# Altium schematic sheet 05_AUDIO.SchDoc
size A2; ApprovedBy: DNP; CheckedBy: DNP; Author: DNP; CompanyName: Google LLC; DrawnBy: DNP; Engineer: Bangfei/Michael/Leo; Organization: Google LLC; Address1: 1600 Amphitheatre Parkway; Address2: Mountain View, CA 94043; Address3: DNP; Address4: DNP; DocumentNumber: DNP; Revision: PVT; SheetNumber: 5; SheetTotal: 11; VersionControl_RevNumber: DNP; IsUserConfigurable: DNP; Time: DNP; ImagePath: DNP; Rule: DNP; ProjectName: Enterprise; Application_BuildNumber: DNP
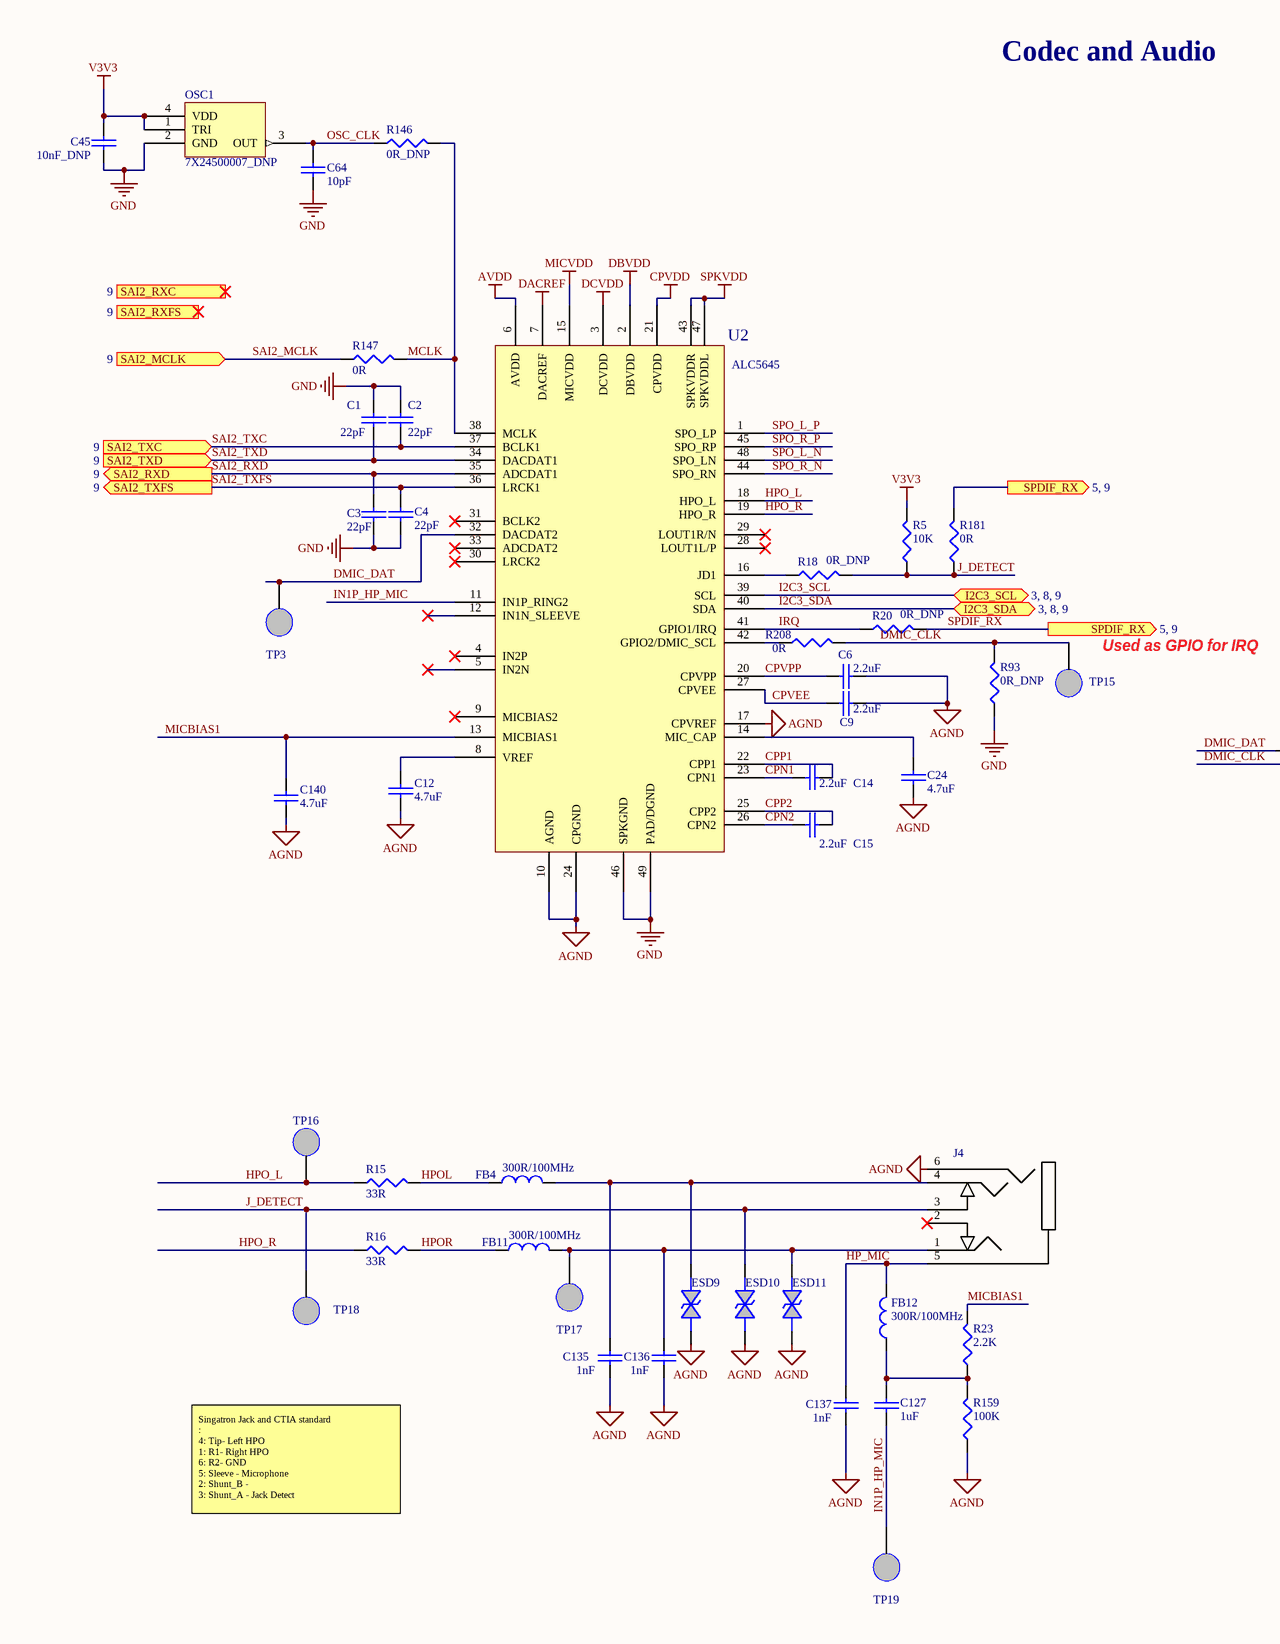
[diagram p0: 05_AUDIO.SchDoc, left]
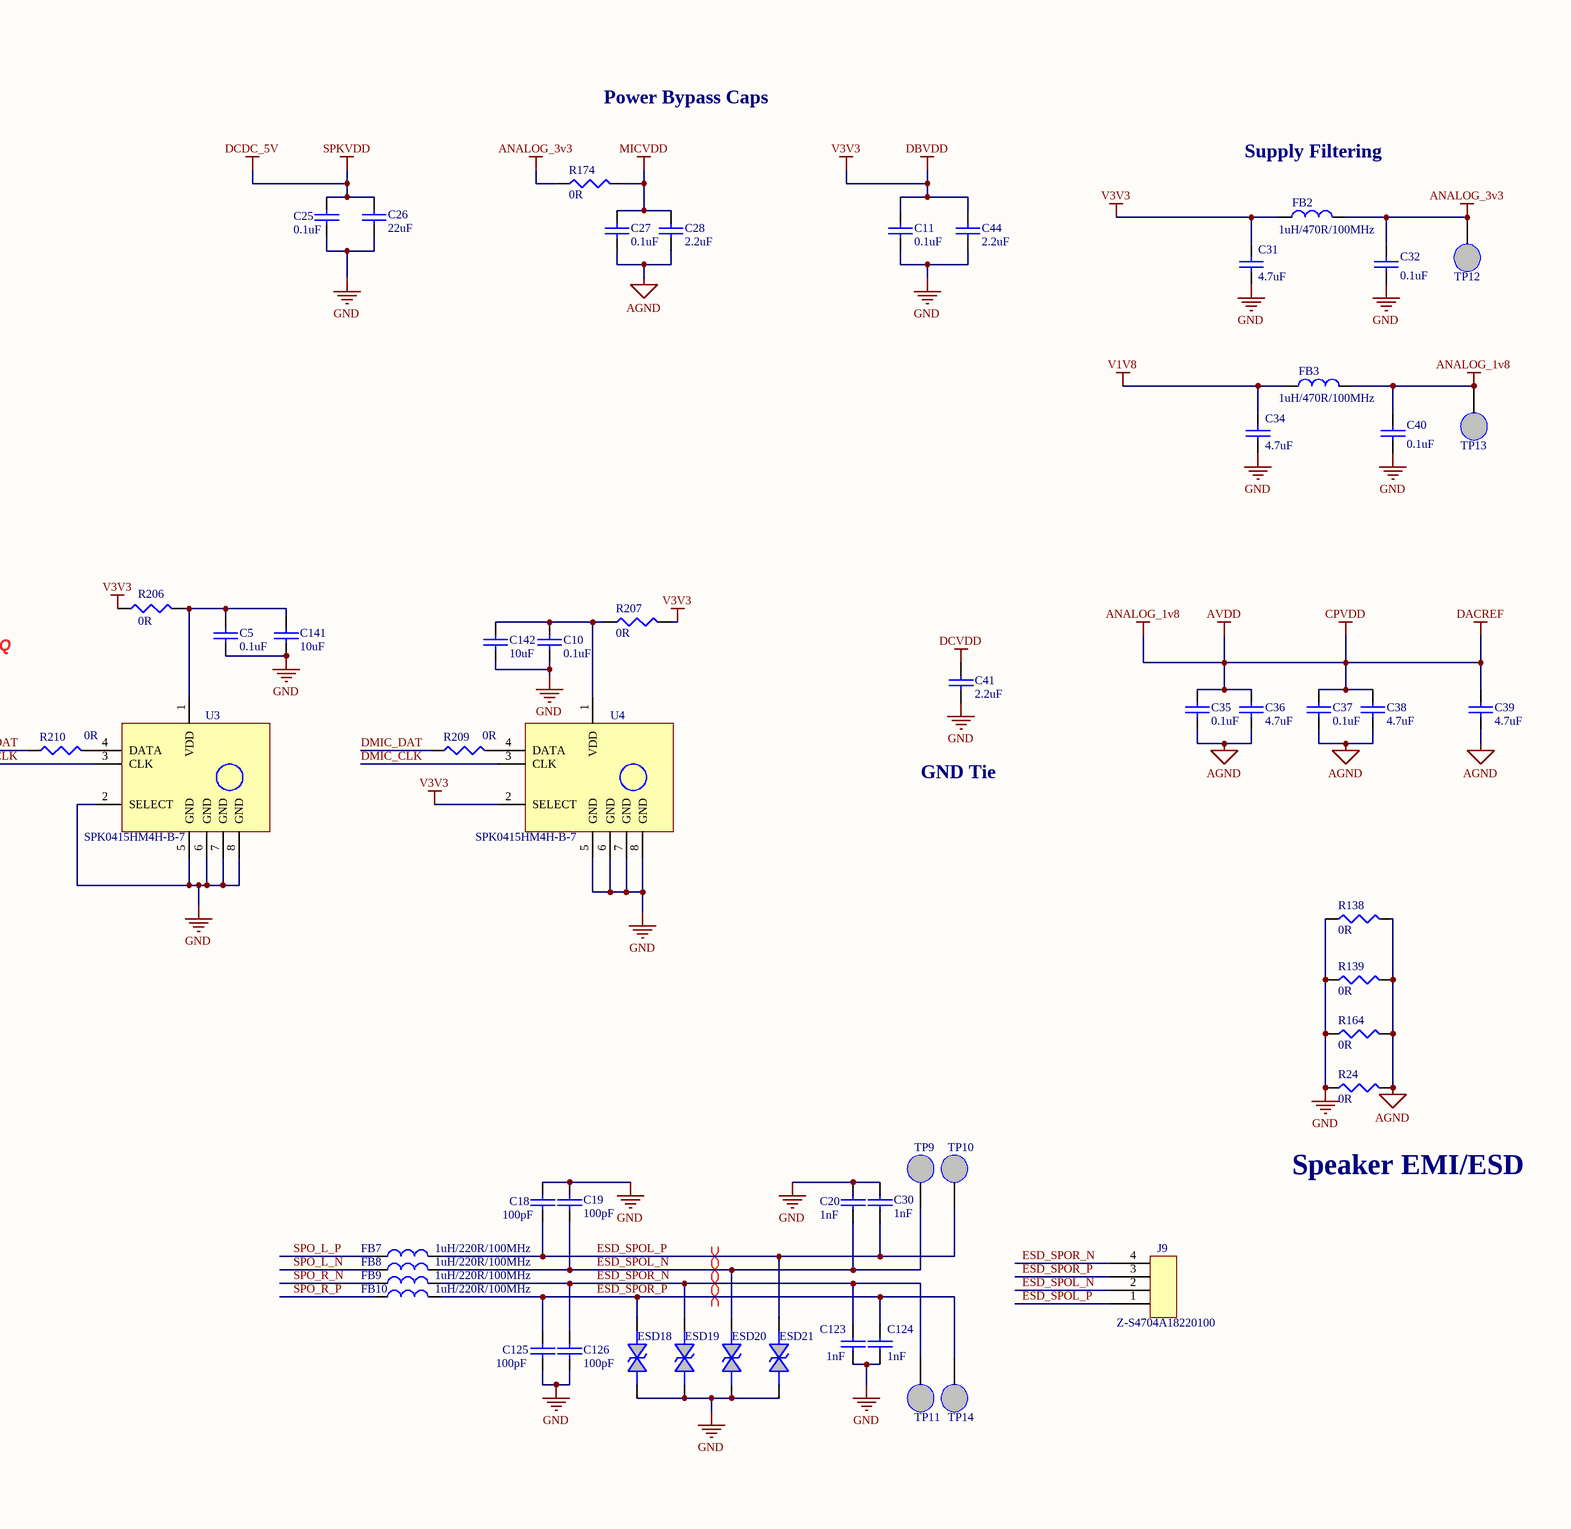
[diagram p1: 05_AUDIO.SchDoc, right]

## Parts
C1  value 22pF  [0201]  (hidden comment: 22pF/6.3V)
C2  value 22pF  [0201]  (hidden comment: 22pF/6.3V)
C3  value 22pF  [0201]  (hidden comment: 22pF/6.3V)
C4  value 22pF  [0201]  (hidden comment: 22pF/6.3V)
C5  value 0.1uF  [0201]  (hidden comment: 0.1uF/10V)
C6  value 2.2uF  [0201]  (hidden comment: 2.2uF/6.3V)
C9  value 2.2uF  [0201]  (hidden comment: 2.2uF/6.3V)
C10  value 0.1uF  [0201]  (hidden comment: 0.1uF/10V)
C11  value 0.1uF  [0201]  (hidden comment: 0.1uF/10V)
C12  value 4.7uF  [0402]  (hidden comment: 4.7uF/10V)
C14  value 2.2uF  [0201]  (hidden comment: 2.2uF/6.3V)
C15  value 2.2uF  [0201]  (hidden comment: 2.2uF/6.3V)
C18  value 100pF  [0201]  (hidden comment: 100pF/25V)
C19  value 100pF  [0201]  (hidden comment: 100pF/25V)
C20  value 1nF  [0201]  (hidden comment: 1nF/25V)
C24  value 4.7uF  [0402]  (hidden comment: 4.7uF/10V)
C25  value 0.1uF  [0402]  (hidden comment: 0.1uF/16V)
C26  value 22uF  [0603]  (hidden comment: 10uF/10V)
C27  value 0.1uF  [0201]  (hidden comment: 0.1uF/10V)
C28  value 2.2uF  [0201]  (hidden comment: 2.2uF/6.3V)
C30  value 1nF  [0201]  (hidden comment: 1nF/25V)
C31  value 4.7uF  [0402]  (hidden comment: 4.7uF/10V)
C32  value 0.1uF  [0603]  (hidden comment: 0.1uF/10V)
C34  value 4.7uF  [0402]  (hidden comment: 4.7uF/10V)
C35  value 0.1uF  [0201]  (hidden comment: 0.1uF/10V)
C36  value 4.7uF  [0402]  (hidden comment: 4.7uF/10V)
C37  value 0.1uF  [0201]  (hidden comment: 0.1uF/10V)
C38  value 4.7uF  [0402]  (hidden comment: 4.7uF/10V)
C39  value 4.7uF  [0402]  (hidden comment: 4.7uF/10V)
C40  value 0.1uF  [0402]  (hidden comment: 0.1uF/16V)
C41  value 2.2uF  [0201]  (hidden comment: 2.2uF/6.3V)
C44  value 2.2uF  [0201]  (hidden comment: 2.2uF/6.3V)
C45  10nF_DNP  [0201]
C64  value 10pF  [0201]  (hidden comment: 10pF/25V)
C123  value 1nF  [0201]  (hidden comment: 1nF/25V)
C124  value 1nF  [0201]  (hidden comment: 1nF/25V)
C125  value 100pF  [0201]  (hidden comment: 100pF/25V)
C126  value 100pF  [0201]  (hidden comment: 100pF/25V)
C127  value 1uF  [0402]  (hidden comment: 1uF/6.3V)
C135  value 1nF  [0201]  (hidden comment: 1nF/25V)
C136  value 1nF  [0201]  (hidden comment: 1nF/25V)
C137  value 1nF  [0201]  (hidden comment: 1nF/25V)
C140  value 4.7uF  [0402]  (hidden comment: 4.7uF/10V)
C141  value 10uF  [0402]  (hidden comment: 10uF/10V)
C142  value 10uF  [0402]  (hidden comment: 10uF/10V)
ESD9  3.5pF/5V  [0201]  (value not drawn)
ESD10  3.5pF/5V  [0201]  (value not drawn)
ESD11  3.5pF/5V  [0201]  (value not drawn)
ESD18  3.5pF/5V  [0201]  (value not drawn)
ESD19  3.5pF/5V  [0201]  (value not drawn)
ESD20  3.5pF/5V  [0201]  (value not drawn)
ESD21  3.5pF/5V  [0201]  (value not drawn)
FB2  1uH/470R/100MHz  [0603]
FB3  1uH/470R/100MHz  [0603]
FB4  300R/100MHz  [0402]
FB7  1uH/220R/100MHz  [0603]
FB8  1uH/220R/100MHz  [0603]
FB9  1uH/220R/100MHz  [0603]
FB10  1uH/220R/100MHz  [0603]
FB11  300R/100MHz  [0402]
FB12  300R/100MHz  [0402]
J4  CONN_2SJ2296-000111  [AUDIO-2SJ2296-000111]  (value not drawn)
J9  Z-S4704A18220100  [SIP4-2_54-S4704A18220100]
OSC1  7X24500007_DNP  [4-SMD-OSC]
R5  10K  [0201]
R15  33R  [0402]
R16  33R  [0402]
R18  0R_DNP  [0201]
R20  0R_DNP  [0201]
R23  2.2K  [0201]
R24  0R  [0201]
R93  0R_DNP  [0201]
R138  0R  [0201]
R139  0R  [0201]
R146  0R_DNP  [0201]
R147  0R  [0201]
R159  100K  [0402]
R164  0R  [0201]
R174  0R  [0402]
R181  0R  [0201]
R206  0R  [0201]
R207  0R  [0201]
R208  0R  [0201]
R209  0R  [0201]
R210  0R  [0201]
TP3  TP NM  [TP_SMD]  (value not drawn)  (no BOM)
TP9  TP NM  [TP_SMD]  (value not drawn)  (no BOM)
TP10  TP NM  [TP_SMD]  (value not drawn)  (no BOM)
TP11  TP NM  [TP_SMD]  (value not drawn)  (no BOM)
TP12  TP NM  [TP_SMD]  (value not drawn)  (no BOM)
TP13  TP NM  [TP_SMD]  (value not drawn)  (no BOM)
TP14  TP NM  [TP_SMD]  (value not drawn)  (no BOM)
TP15  TP NM  [TP_SMD]  (value not drawn)  (no BOM)
TP16  TP NM  [TP_SMD]  (value not drawn)  (no BOM)
TP17  TP NM  [TP_SMD]  (value not drawn)  (no BOM)
TP18  TP NM  [TP_SMD]  (value not drawn)  (no BOM)
TP19  TP NM  [TP_SMD]  (value not drawn)  (no BOM)
U2  ALC5645  [CODEC_ALC5645]
U3  SPK0415HM4H-B-7  [Microphone_SPK0415HM4H-B-7]
U4  SPK0415HM4H-B-7  [Microphone_SPK0415HM4H-B-7]

## Ports
I2C3_SCL (bidir, see 3, 8, 9), I2C3_SDA (bidir, see 3, 8, 9), SAI2_MCLK (in, see 9), SAI2_RXC (in, see 9), SAI2_RXD (out, see 9), SAI2_RXFS (in, see 9), SAI2_TXC (in, see 9), SAI2_TXD (in, see 9), SAI2_TXFS (out, see 9), SPDIF_RX (out, see 5, 9)

## Nets
AGND: C6.2 C9.2 C12.2 C24.1 C27.2 C28.2 C35.2 C36.2 C37.2 C38.2 C39.2 C135.1 C136.1 C137.1 C140.2 ESD9.1 ESD10.1 ESD11.1 J4.6(RING_B) R24.2 R138.2 R139.2 R159.1 R164.2 U2.10(AGND) U2.17(CPVREF) U2.24(CPGND)
ANALOG_1v8: C35.1 C36.1 C37.1 C38.1 C39.1 C40.1 FB3.2 TP13.1 U2.6(AVDD) U2.7(DACREF) U2.21(CPVDD)  [also labelled AVDD, CPVDD, DACREF]
ANALOG_3v3: C32.1 FB2.2 R174.1 TP12.1
DBVDD: C11.1 C31.1 C44.1 C45.1 FB2.1 OSC1.1(TRI) OSC1.4(VDD) R5.2 R206.1 R207.2 U2.2(DBVDD) U4.2(SELECT)  [also labelled V3V3]
DCDC_5V: C25.1 C26.1 U2.43(SPKVDDR) U2.47(SPKVDDL)  [also labelled SPKVDD]
DCVDD: C41.1 U2.3(DCVDD)
GND: C1.1 C2.1 C3.2 C4.2 C5.2 C10.2 C11.2 C18.1 C19.1 C20.2 C25.2 C26.2 C30.2 C31.2 C32.2 C34.2 C40.2 C41.2 C44.2 C45.2 C64.2 C123.1 C124.1 C125.2 C126.2 C141.2 C142.2 ESD18.1 ESD19.1 ESD20.1 ESD21.1 OSC1.2(GND) R24.1 R93.1 R138.1 R139.1 R164.1 U2.46(SPKGND) U2.49(PAD/DGND) U3.2(SELECT) U3.5(GND) U3.6(GND) U3.7(GND) U3.8(GND) U4.5(GND) U4.6(GND) U4.7(GND) U4.8(GND)
MICVDD: C27.1 C28.1 R174.2 U2.15(MICVDD)
V1V8: C34.1 FB3.1
CPN1: C14.1 U2.23(CPN1)
CPN2: C15.1 U2.26(CPN2)
CPP1: C14.2 U2.22(CPP1)
CPP2: C15.2 U2.25(CPP2)
CPVEE: C9.1 U2.27(CPVEE)
CPVPP: C6.1 U2.20(CPVPP)
DMIC_CLK: R93.2 R208.2 TP15.1 U3.3(CLK) U4.3(CLK)
DMIC_DAT: R209.1 R210.1 TP3.1 U2.32(DACDAT2)
ESD_SPOL_N: C19.2 C20.1 ESD20.2 FB8.2 J9.2 TP9.1
ESD_SPOL_P: C18.2 C30.1 ESD21.2 FB7.2 J9.1 TP10.1
ESD_SPOR_N: C123.2 C126.1 ESD19.2 FB9.2 J9.4 TP11.1
ESD_SPOR_P: C124.2 C125.1 ESD18.2 FB10.2 J9.3 TP14.1
HP_MIC: C137.2 FB12.2 J4.5(SLEEVE)
HPO_L: R15.1 TP16.1 U2.18(HPO_L)
HPO_R: R16.1 U2.19(HPO_R)
HPOL: FB4.1 R15.2
HPOR: FB11.1 R16.2
I2C3_SCL: U2.39(SCL) ; port I2C3_SCL
I2C3_SDA: U2.40(SDA) ; port I2C3_SDA
IN1P_HP_MIC: C127.2 TP19.1 U2.11(IN1P_RING2)
IRQ: R20.1 U2.41(GPIO1/IRQ)
J_DETECT: ESD10.2 J4.3(SHUNT_A) R5.1 R18.2 R181.1 TP18.1
MCLK: R146.2 R147.2 U2.38(MCLK)
MICBIAS1: C140.1 R23.2 U2.13(MICBIAS1)
OSC_CLK: C64.1 OSC1.3(OUT) R146.1
SAI2_MCLK: R147.1 ; port SAI2_MCLK
SAI2_RXD: C3.1 U2.35(ADCDAT1) ; port SAI2_RXD
SAI2_TXC: C2.2 U2.37(BCLK1) ; port SAI2_TXC
SAI2_TXD: C1.2 U2.34(DACDAT1) ; port SAI2_TXD
SAI2_TXFS: C4.1 U2.36(LRCK1) ; port SAI2_TXFS
SPDIF_RX: R20.2 R181.2 ; port SPDIF_RX
SPO_L_N: FB8.1 U2.48(SPO_LN)
SPO_L_P: FB7.1 U2.1(SPO_LP)
SPO_R_N: FB9.1 U2.44(SPO_RN)
SPO_R_P: FB10.1 U2.45(SPO_RP)
NetC5_1: C5.1 C141.1 R206.2 U3.1(VDD)
NetC10_1: C10.1 C142.1 R207.1 U4.1(VDD)
NetC12_1: C12.1 U2.8(VREF)
NetC24_2: C24.2 U2.14(MIC_CAP)
NetC127_1: C127.1 FB12.1 R23.1 R159.2
NetC135_2: C135.2 ESD9.2 FB4.2 J4.4(TIP_SPRING)
NetC136_2: C136.2 ESD11.2 FB11.2 J4.1(RING_A) TP17.1
NetR18_1: R18.1 U2.16(JD1)
NetR208_1: R208.1 U2.42(GPIO2/DMIC_SCL)
NetR209_2: R209.2 U4.4(DATA)
NetR210_2: R210.2 U3.4(DATA)

Not connected (* = marked no-connect by the designer): J4 2(SHUNT_B)*; U2 4(IN2P)* 5(IN2N)* 9(MICBIAS2)* 12(IN1N_SLEEVE)* 28(LOUT1L/P)* 29(LOUT1R/N)* 30(LRCK2)* 31(BCLK2)* 33(ADCDAT2)*

## Layout directives
differential pair: ESD_SPOL_N, ESD_SPOL_P, ESD_SPOR_N, ESD_SPOR_P

## Notes on the sheet
- Codec and Audio
- Power Bypass Caps
- Supply Filtering
- (near TP15) Used as GPIO for IRQ
- GND Tie
- Speaker EMI/ESD
- Singatron Jack and CTIA standard
  :
  4: Tip- Left HPO
  1: R1- Right HPO
  6: R2- GND
  5: Sleeve - Microphone
  2: Shunt_B -
  3: Shunt_A - Jack Detect
  Shunt A (pin #3) is normally closed with pin #4; Shunt B (pin #2) is normally closed with pin #1.
  When plug inserted, Shunt A (pin #3) is open from pin # 4 & Shunt B (pin #2) is open from pin #1.
- Project:
- Engineer:
- Date:
- File:
- Revision:
- Sheet
- of

## Library data of the parts
C1-C4 = CAP_0201_22pF: CAP CER 22pF 6.3V 2% C0G NP0 0201; MPN: GJM0335C0J220GB01D; QCI MPN: GRM0335C1H220G; QPN: CH0226G0E00; QPN Description: CAP CHIP 22PF 50V(+-2%,COG,0201); Function Code: ADO; Supplier 1: Digi-Key; Supplier Part Number 1: 490-6067-2-ND; QCI Supplier: MUR
C5 C10 C11 C27 C35 C37 = CAP_0201_0.1uF: CAP CER 0.1UF 10V 10% X5R 0201; MPN: C0603X5R1A104K030BC; QCI MPN: GRM033R61A104K; QPN: CH4102K9E00; QPN Description: CAP CHIP 0.1U 10V(+-10%,X5R,0201); Function Code: ADO; Supplier 1: Digi-Key; Supplier Part Number 1: 445-7318-1-ND; QCI Supplier: MUR
C6 C9 C14 C15 C28 C41 C44 = CAP_0201_2.2uF: CAP CER 2.2uF 6.3V 20% X5R 0201; MPN: GRM033R60J225ME15D; QCI MPN: GRM033R60J225M; QPN: CH5221M9E00; QPN Description: CAP CHIP 2.2UF 6.3V(+-20%,X5R,0201); Function Code: ADO; Supplier 1: Digi-Key; Supplier Part Number 1: 490-13224-2-ND; QCI Supplier: MUR
C12 C24 C36 C38 C39 C140 = CAP_0201_4.7uF: CAP CER 4.7UF 10V 20% X5R 0402; MPN: C1005X5R1A475M050BC; QCI MPN: GRM155R61A475M; QPN: CH5472M9B01; QPN Description: CAP CHIP 4.7U 10V(+-20%,X5R,0402); Function Code: ADO; Supplier 1: Digi-Key; Supplier Part Number 1: 445-8023-1-ND; QCI Supplier: MUR
C18 C19 C125 C126 = CAP_0201_100pF: CAP CER 100PF 25V X7R 0201; MPN: GRM033R71E101KA01D; QCI MPN: GRM033R71E101K; QPN: CH1104K1E01; QPN Description: CAP CHIP 100PF 25V(+-10%,X7R,0201); Function Code: SPK; Supplier 1: Digi-Key; Supplier Part Number 1: 490-3172-1-ND; QCI Supplier: MUR
C20 C30 C123 C124 = CAP_0201_1.0nF: CAP CER 1nF 25V 10% X7R 0201; MPN: GRM033R71E102KA01D; QCI MPN: GRM033R71E102K; QPN: CH2104K1E00; QPN Description: CAP CHIP 1000P 25V(+-10%,X7R,0201); Function Code: SPK; Supplier 1: Digi-Key; Supplier Part Number 1: 490-3184-2-ND; QCI Supplier: MUR
C25 C40 = CAP_0402_0.1uF: CAP CER 0.1uF 16V 10% X7R 0402; MPN: C0402C104K4RACTU; QCI MPN: GRM155R71C104K; QPN: CH4103K1B18; QPN Description: CAP CHIP 0.1U 16V(10%,X7R,0402); Function Code: ADO; Supplier 1: Digi-Key; Supplier Part Number 1: 399-3521-1-ND; QCI Supplier: MUR
C26 = CAP_0603_22uF: CAP CER 22UF 6.3V 10% X5R 0603; MPN: CL10A226KQ8NRNE; QCI MPN: GRM188R61A106M; QPN: CH6102M9900; QPN Description: CAP CHIP 10U 10V(+-20%,X5R,0603); Function Code: USB; Supplier 1: Digi-Key; Supplier Part Number 1: 1276-2867-2-ND; QCI Supplier: MUR
C31 C34 = CAP_0402_4.7uF: CAP CER 4.7UF 10V 20% X5R 0402; MPN: C1005X5R1A475M050BC; QCI MPN: GRM155R61A475M; QPN: CH5472M9B01; QPN Description: CAP CHIP 4.7U 10V(+-20%,X5R,0402); Function Code: ADO; Supplier 1: Digi-Key; Supplier Part Number 1: 445-8023-1-ND; QCI Supplier: MUR
C32 = CAP_0603_0.1uF: CAP CER 0.1UF 10V 10% X5R 0603; MPN: GRM188R71C104M; QCI MPN: 0603B104K100CT; QPN: CH4102K1900; QPN Description: CAP CHIP 0.1UF 10V(+-10%,X7R,0603); Function Code: ADO; Supplier 1: Digi-Key; Supplier Part Number 1: 490-1519-1-ND; QCI Supplier: WTC
C45 = CAP_0201_10nF: CAP CER 0.01UF 10V 10% X5R 0201; MPN: GRM033R61A103KA01D; QCI MPN: GRM033R71A103K; DNP: V; QPN: CH3102K1E01; QPN Description: CAP CHIP 0.01UF 10V(10%,X7R,0201); Function Code: ADO; Supplier 1: Digi-Key; Value: 10nF_DNP; Supplier Part Number 1: 490-3166-1-ND; QCI Supplier: MUR
C64 = CAP_0201_10pF_HF: CAP CER 10PF 25V 5% C0H 0201; MPN: GJM0336C1E100JB01D; QCI MPN: GRM0335C1E100J; QPN: CH0104J0E05; QPN Description: CAP CHIP 10P 25V(+-5%,COG,0201); Function Code: ADO; Supplier 1: Digi-Key; Supplier Part Number 1: 490-11187-1-ND; QCI Supplier: MUR
C127 = CAP_0402_1.0uF: CAP CER 1.0UF 6.3V 10% X5R 0402; MPN: C0603X5R0J105M030BC; QCI MPN: GRM155R70J105K; QPN: CH5101K1B01; QPN Description: CAP CHIP 1U,6.3V(+-10%,X7R,0402); Function Code: AMJ; Supplier 1: Digi-Key; Supplier Part Number 1: 399-4873-1-ND; QCI Supplier: MUR
C135-C137 = CAP_0201_1.0nF: CAP CER 1nF 25V 10% X7R 0201; MPN: GRM033R71E102KA01D; QCI MPN: GRM033R71E102K; QPN: CH2104K1E00; QPN Description: CAP CHIP 1000P 25V(+-10%,X7R,0201); Function Code: AMJ; Supplier 1: Digi-Key; Supplier Part Number 1: 490-3184-2-ND; QCI Supplier: MUR
C141 C142 = CAP_0402_10uF: CAP CER 10UF 10V 20% X5R 0402; MPN: CL05A106MP5NUNC; QCI MPN: GRM155R61A106M; QPN: CH6102M9B00; QPN Description: CAP CHIP 10U 10V (+-20%, X5R, 0402)'; Function Code: LAN; Supplier 1: Digi-Key; Supplier Part Number 1: 1276-1450-1-ND; QCI Supplier: MUR
ESD9-ESD11 = DIODE BI-DIR TRIG: DIODE TVS 15kV 10V 50A 8pF SMT RoHS; MPN: DESD5V0V1BCSP-7; QPN: BC5V0V1BZ02; QPN Description: DIODE ESD SMD DESD5V0V1BCSP-7 6V,DSN0603; Function Code: AMJ; QCI MPN: DESD5V0V1BCSP-7; QCI Supplier: DDS
ESD18-ESD21 = DIODE BI-DIR TRIG: DIODE TVS 15kV 10V 50A 8pF SMT RoHS; MPN: DESD5V0V1BCSP-7; QPN: BC5V0V1BZ02; QPN Description: DIODE ESD SMD DESD5V0V1BCSP-7 6V,DSN0603; Function Code: SPK; QCI MPN: DESD5V0V1BCSP-7; QCI Supplier: DDS
FB2 FB3 = INDUCTOR_BLM18PG471SN1: FERRITE CHIP 470 OHM 1.0A 0603; QCI MPN: BLM18PG471SN1D; QPN: CX8PG471000; QPN Description: EMI FILTER BLM18PG471SN1D(470,1000MA); Function Code: ADO; Supplier 1: Digi-Key; Supplier Part Number 1: 445-5222-2-ND; Value: 1uH/470R/100MHz; QCI Supplier: MUR; MPN: BLM18PG471SN1
FB4 FB11 FB12 = INDUCTOR_BLM18EG221SN1D: EMI FILTER FCM1005KF-301T03 (300,300MA); Value: 1uH; QPN: CX301T03000; Function Code: AMJ; Supplier 1: Digi-Key; Supplier Part Number 1: 490-3992-1-ND; QCI Supplier: TTA; MPN: FCM1005KF-301T03; QCI MPN: FCM1005KF-301T03; QPN Description: EMI FILTER FCM1005KF-301T03 (300,300MA)
FB7-FB10 = INDUCTOR_BLM18EG221SN1D: FERRITE CHIP 220 OHM 2.0A 0603; Value: 1uH; QPN: CX8EG221011; QPN Description: EMI FILTER BLM18EG221SN1D(220,2A); Function Code: SPK; Supplier 1: Digi-Key; Supplier Part Number 1: 490-3992-1-ND; QCI Supplier: MUR; MPN: BLM18EG221SN1D; QCI MPN: BLM18EG221SN1D
J4 = CONN_2SJ2296-000111: CONN AUDIO JACK 3.5MM 6COND SMD; QPN: DFTJ06FR320; QPN Description: CONN SMD PHONE JACK 6P FR(H4.5); Function Code: AMJ; MPN: 2SJ2296-000111; QCI MPN: 2SJ2296-000111; QCI Supplier: SIT
J9 = CONN_TERMINAL_4POS_PHOENIX: CONN TERM BLOCK 2.54MM 4POS PCB; QPN: DFHS04FR969; QPN Description: CONN DIP HOUSING 4P 1R FR(P2.54,H8.5); Function Code: SPK; Supplier 1: Digi-Key; MPN: Z-S4704A18220100; QCI MPN: Z-S4704A18220100; QCI Supplier: NEX
OSC1 = OSC_7X24500007: 24.576MHz SINE Oscillator Surface Mount 3.3V 13mA Enable/Disable; DNP: V; Function Code: ADO; MPN: 7X24500007_DNP
R5 = R_0201_10K: RES SMD 10K OHM JUMPER 1/20W  0201; MPN: ERJ-1GEF103C; QCI MPN: RC0201JR-1310KL; QPN: CS31001JE16; QPN Description: RES CHIP 10K 1/20W +-5%(0201); Function Code: ADO; Supplier 1: Digi-Key; VALUE: 10K; Supplier Part Number 1: P10.0KABCT-ND; QCI Supplier: YGO
R15 R16 = R_0402_33: RES SMD 33 OHM 1% 1/10W 0402; MPN: RC0402FR-0733R; QPN: CS03302FB01; QPN Description: RES CHIP 33 1/16W +-1%(0402); Function Code: AMJ; Supplier 1: Digi-Key; Supplier Part Number 1: P33.0LTR-ND; VALUE: 33R; QCI Supplier: YGO; QCI MPN: RC0402FR-0733R
R18 R20 R93 R146 = R_0201_0: RES SMD 0.0OHM JUMPER 1/20W 0201; MPN: ERJ-1GN0R00C; QCI MPN: RC0201JR-130RL; DNP: V; QPN: CS00001JE18; QPN Description: RES CHIP 0(1/20W,+-5%,0201); Function Code: ADO; Supplier 1: Digi-Key; Supplier Part Number 1: P15979CT-ND; VALUE: 0R_DNP; QCI Supplier: YGO
R23 = R_0201_2.2K: RES SMD 2.2K OHM 1% 1/20W 0201; MPN: ERJ-1GEF2201C; QCI MPN: RC0201FR-072K2L; QPN: CS22201FE04; QPN Description: RES CHIP 2.2K 1/20W +-1%(0201); Function Code: AMJ; Supplier 1: Digi-Key; Supplier Part Number 1: P2.20KABCT-ND; VALUE: 2.2K; QCI Supplier: YGO
R24 R138 R139 R164 R206-R210 = R_0805_0: RES SMD 0.0OHM JUMPER 1/20W 0201; MPN: ERJ-1GN0R00C; QCI MPN: RC0201JR-130RL; QPN: CS00001JE18; QPN Description: RES CHIP 0(1/20W,+-5%,0201); Function Code: SPK; Supplier 1: Digi-Key; Supplier Part Number 1: P15979CT-ND; Value: 0R; QCI Supplier: YGO
R147 R181 = R_0201_0: RES SMD 0.0OHM JUMPER 1/20W 0201; MPN: ERJ-1GN0R00C; QCI MPN: RC0201JR-130RL; QPN: CS00001JE18; QPN Description: RES CHIP 0(1/20W,+-5%,0201); Function Code: ADO; Supplier 1: Digi-Key; Supplier Part Number 1: P15979CT-ND; VALUE: 0R; QCI Supplier: YGO
R159 = R_0402_1.6k: RES CHIP 100K 1/16W 5%(0402); MPN: YAG3045TR-ND; QCI MPN: RC0402JR-7D100KL; QPN: CS41002JB20; Function Code: AMJ; Supplier 1: Digi-Key; Supplier Part Number 1: YAG3045TR-ND; VALUE: 100K; QCI Supplier: YGO; QPN Description: RES CHIP 100K 1/16W 5%(0402)
R174 = R_0402_0: RES SMD 0.0 OHM JUMPER 1/10W  0402; MPN: ERJ-2GE0R00X; QCI MPN: RC0402FR-070RL; QPN: CS00002FB00; QPN Description: RES CHIP 0 1/16W +-1%(0402); Function Code: DBG; Supplier 1: Digi-Key; Supplier Part Number 1: P0.0JCT-ND; VALUE: 0R; QCI Supplier: YGO
TP3 TP9-TP19 = TP: TEST POIN
U2 = ALC5645: Multi-Channel Audio Hub/CODEC and SounzReal Digital Sound Effect; QCI MPN: ALC5645-CGT; QPN: AL005645000; QPN Description: IC OTHER(48P) ALC5645-CGT(QFN); Function Code: ADO; MPN: ALC5645; QCI Supplier: RSC
U3 U4 = Microphone_SPK0415HM4H-B-7: Microphone MEMS, Digital PDM OMNI -26dB; QPN: DN0415HM000; QPN Description: MICPHONE SPK0415HM4H-B-7; Function Code: ADO; Supplier 1: Digikey; MPN: SPK0415HM4H-B-7; QCI MPN: SPK0415HM4H-B-7; QCI Supplier: EIP